# Altium schematic sheet Sheet2.SchDoc
size A4; SheetNumber: 1; SheetTotal: 1
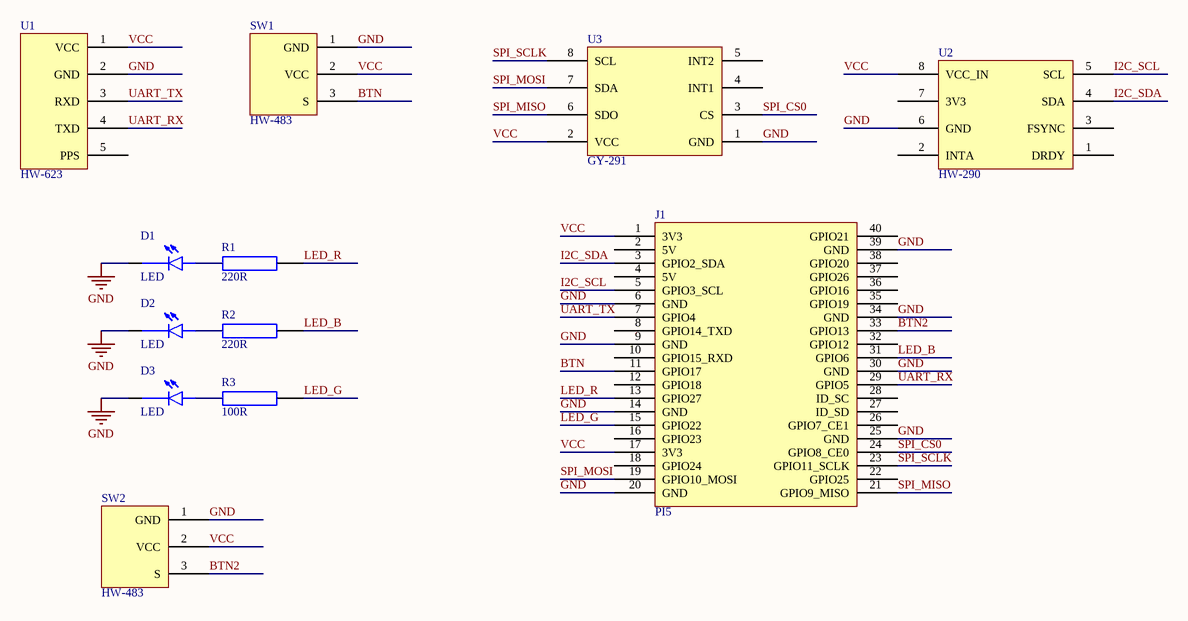
[diagram p0: Sheet2.SchDoc]

## Parts
D1  LED  [LED]
D2  LED  [LED]
D3  LED  [LED]
J1  PI5  [PI5]
R1  220R  [Resistor]
R2  220R  [Resistor]
R3  100R  [Resistor]
SW1  HW-483  [HW-483]
SW2  HW-483  [HW-483]
U1  HW-623  [HW-623]
U2  HW-290  [HW-290]
U3  GY-291  [GY-291]

## Nets
GND: D1.C D2.C D3.C J1.6(GND) J1.9(GND) J1.14(GND) J1.20(GND) J1.25(GND) J1.30(GND) J1.34(GND) J1.39(GND) SW1.1(GND) SW2.1(GND) U1.2(GND) U2.6(GND) U3.1(GND)
BTN: J1.11(GPIO17) SW1.3(S)
BTN2: J1.33(GPIO13) SW2.3(S)
I2C_SCL: J1.5(GPIO3_SCL) U2.5(SCL)
I2C_SDA: J1.3(GPIO2_SDA) U2.4(SDA)
LED_B: J1.31(GPIO6) R2.2
LED_G: J1.15(GPIO22) R3.2
LED_R: J1.13(GPIO27) R1.2
SPI_CS0: J1.24(GPIO8_CE0) U3.3(CS)
SPI_MISO: J1.21(GPIO9_MISO) U3.6(SDO)
SPI_MOSI: J1.19(GPIO10_MOSI) U3.7(SDA)
SPI_SCLK: J1.23(GPIO11_SCLK) U3.8(SCL)
UART_RX: J1.29(GPIO5) U1.4(TXD)
UART_TX: J1.7(GPIO4) U1.3(RXD)
VCC: J1.1(3V3) J1.17(3V3) SW1.2(VCC) SW2.2(VCC) U1.1(VCC) U2.8(VCC_IN) U3.2(VCC)
NetD1_A: D1.A R1.1
NetD2_A: D2.A R2.1
NetD3_A: D3.A R3.1

Not connected (* = marked no-connect by the designer): J1 2(5V) 4(5V) 8(GPIO14_TXD) 10(GPIO15_RXD) 12(GPIO18) 16(GPIO23) 18(GPIO24) 22(GPIO25) 26(GPIO7_CE1) 27(ID_SD) 28(ID_SC) 32(GPIO12) 35(GPIO19) 36(GPIO16) 37(GPIO26) 38(GPIO20) 40(GPIO21); U1 5(PPS); U2 1 (DRDY) 2(INTA) 3(FSYNC) 7(3V3); U3 4(INT1) 5(INT2)

## Library data of the parts
R1-R3 = Resistor
U2 = HW290_GY87